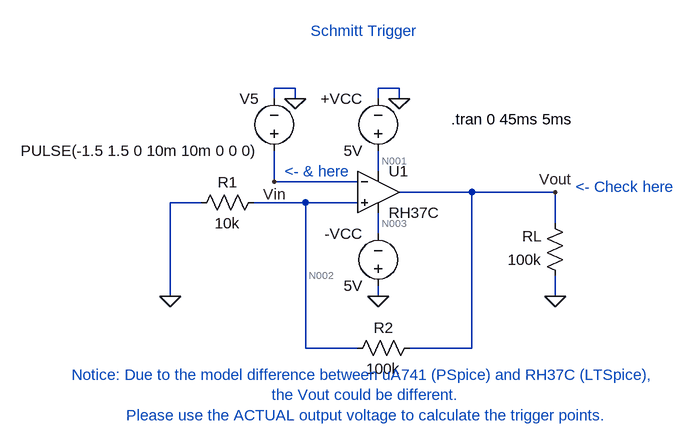
[diagram p0: schematic HLab02_Schmitt_trigger_triangle.asc]
HLab02_Schmitt_trigger_triangle.asc, the LTspice schematic file:
Version 4
SHEET 1 1100 704
WIRE 64 160 32 160
WIRE 224 160 192 160
WIRE 32 176 32 160
WIRE 64 176 64 160
WIRE 192 176 192 160
WIRE 224 176 224 160
WIRE 192 288 192 256
WIRE 32 304 32 256
WIRE 160 304 32 304
WIRE 336 320 224 320
WIRE 464 320 336 320
WIRE -80 336 -128 336
WIRE 80 336 0 336
WIRE 160 336 80 336
WIRE 464 368 464 320
WIRE 192 384 192 352
WIRE -128 480 -128 336
WIRE 192 480 192 464
WIRE 464 480 464 448
WIRE 80 560 80 336
WIRE 160 560 80 560
WIRE 336 560 336 320
WIRE 336 560 240 560
FLAG 224 176 0
FLAG 192 480 0
FLAG 64 176 0
FLAG -128 480 0
FLAG 464 480 0
FLAG 464 320 Vout
FLAG 32 304 Vin
SYMBOL voltage 192 480 R180
WINDOW 0 24 96 Left 2
WINDOW 3 24 16 Left 2
SYMATTR InstName -VCC
SYMATTR Value 5V
SYMBOL voltage 192 272 R180
WINDOW 0 24 96 Left 2
WINDOW 3 24 16 Left 2
SYMATTR InstName +VCC
SYMATTR Value 5V
SYMBOL voltage 32 272 R180
WINDOW 0 24 96 Left 2
WINDOW 3 24 16 Left 2
WINDOW 123 0 0 Left 0
WINDOW 39 0 0 Left 0
SYMATTR InstName V5
SYMATTR Value PULSE(-1.5 1.5 0 10m 10m 0 0 0)
SYMBOL res 16 320 R90
WINDOW 0 0 56 VBottom 2
WINDOW 3 32 56 VTop 2
SYMATTR InstName R1
SYMATTR Value 10k
SYMBOL res 256 544 R90
WINDOW 0 0 56 VBottom 2
WINDOW 3 32 56 VTop 2
SYMATTR InstName R2
SYMATTR Value 100k
SYMBOL res 480 464 R180
WINDOW 0 36 76 Left 2
WINDOW 3 36 40 Left 2
SYMATTR InstName RL
SYMATTR Value 100k
SYMBOL Opamps/RH37C 192 256 R0
SYMATTR InstName U1
TEXT 304 208 Left 2 !.tran 0 45ms 5ms
TEXT 88 72 Left 2 ;Schmitt Trigger
TEXT 496 312 Left 2 ;<- Check here
TEXT 48 288 Left 2 ;<- & here
TEXT 176 632 Center 2 ;Notice: Due to the model difference between uA741 (PSpice) and RH37C (LTSpice), \nthe Vout could be different. \nPlease use the ACTUAL output voltage to calculate the trigger points.

The netlist it stands for:
* HLab02_Schmitt_trigger_triangle.asc
V§-VCC 0 N003 5V
V§+VCC N001 0 5V
V5 Vin 0 PULSE(-1.5 1.5 0 10m 10m 0 0 0)
R1 N002 0 10k
R2 Vout N002 100k
RL 0 Vout 100k
XU1 N002 Vin N001 N003 Vout RH37C  ; pins In+ In- V+ V- OUT
.tran 0 45ms 5ms
* Schmitt Trigger
* <- Check here
* <- & here
* Notice: Due to the model difference between uA741 (PSpice) and RH37C (LTSpice),
* the Vout could be different.
* Please use the ACTUAL output voltage to calculate the trigger points.
.backanno
.end

* Results of the author's LTspice run, read from the files saved beside the schematic
* Operating Point, zero values left out:
*   V(n003) = -5 V
*   V(n001) = 5 V
*   V(vin) = -1.5 V
*   V(n002) = -638.2 mV
*   V(vout) = 4.16 V
*   I(Rl) = -41.6 µA
*   I(R2) = 47.98 µA
*   I(R1) = -63.82 µA
*   I(V5) = 111.8 µA
*   I(+vcc) = -2.246 mA
*   I(-vcc) = -2.156 mA
*   Ix(u1:1) = 111.8 µA
*   Ix(u1:2) = -111.8 µA
*   Ix(u1:3) = 2.246 mA
*   Ix(u1:4) = -2.156 mA
*   Ix(u1:5) = -89.58 µA
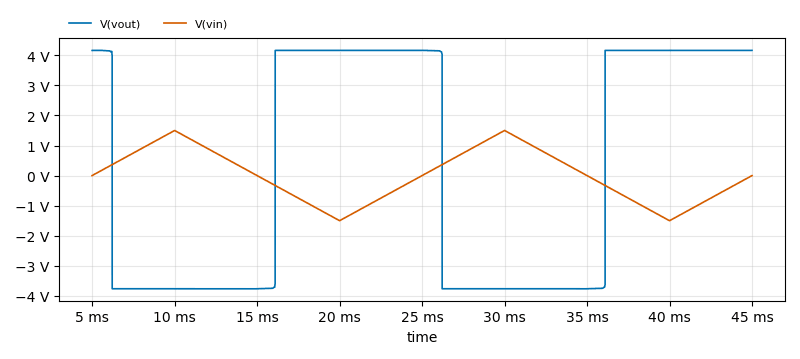
[diagram p1: Transient Analysis of HLab02_Schmitt_trigger_triangle.asc, plotted from the saved traces]
* Transient Analysis, 1 run:
*   V(vout): min -3.763 V, max 4.162 V, average 247.7 mV, rms 3.967 V, last 4.161 V
*   V(vin): min -1.5 V, max 1.499 V, average -29.78 µV, rms 882.8 mV, last 0 V